# Altium schematic sheet Switch_Matrix_32_2_EEM.SchDoc: Switch Matrix 32:2
size 420 x 297 mm; EDA_Number: ARTIQ; Projet: Switch Matrix 32:2; Author: G.Kasprowicz; CompanyName: WUT ISE; DrawnBy: G.Kasprowicz; Organization: WUT ISE; Address1: PW ISE; Address2: Nowowiejska 15/19 00-665 Warsaw; Address3: gkasprow@gmail.com; DocumentNumber: 4; Revision: 2; SheetNumber: 4; SheetTotal: 6; ModifiedBy: -; CheckedDate: -; Title2: FPGA EEM connections; DivGrp: WUT ISE; Designer: G.Kasprowicz; ModifiedDate: -; ProjectName: Sensor Box
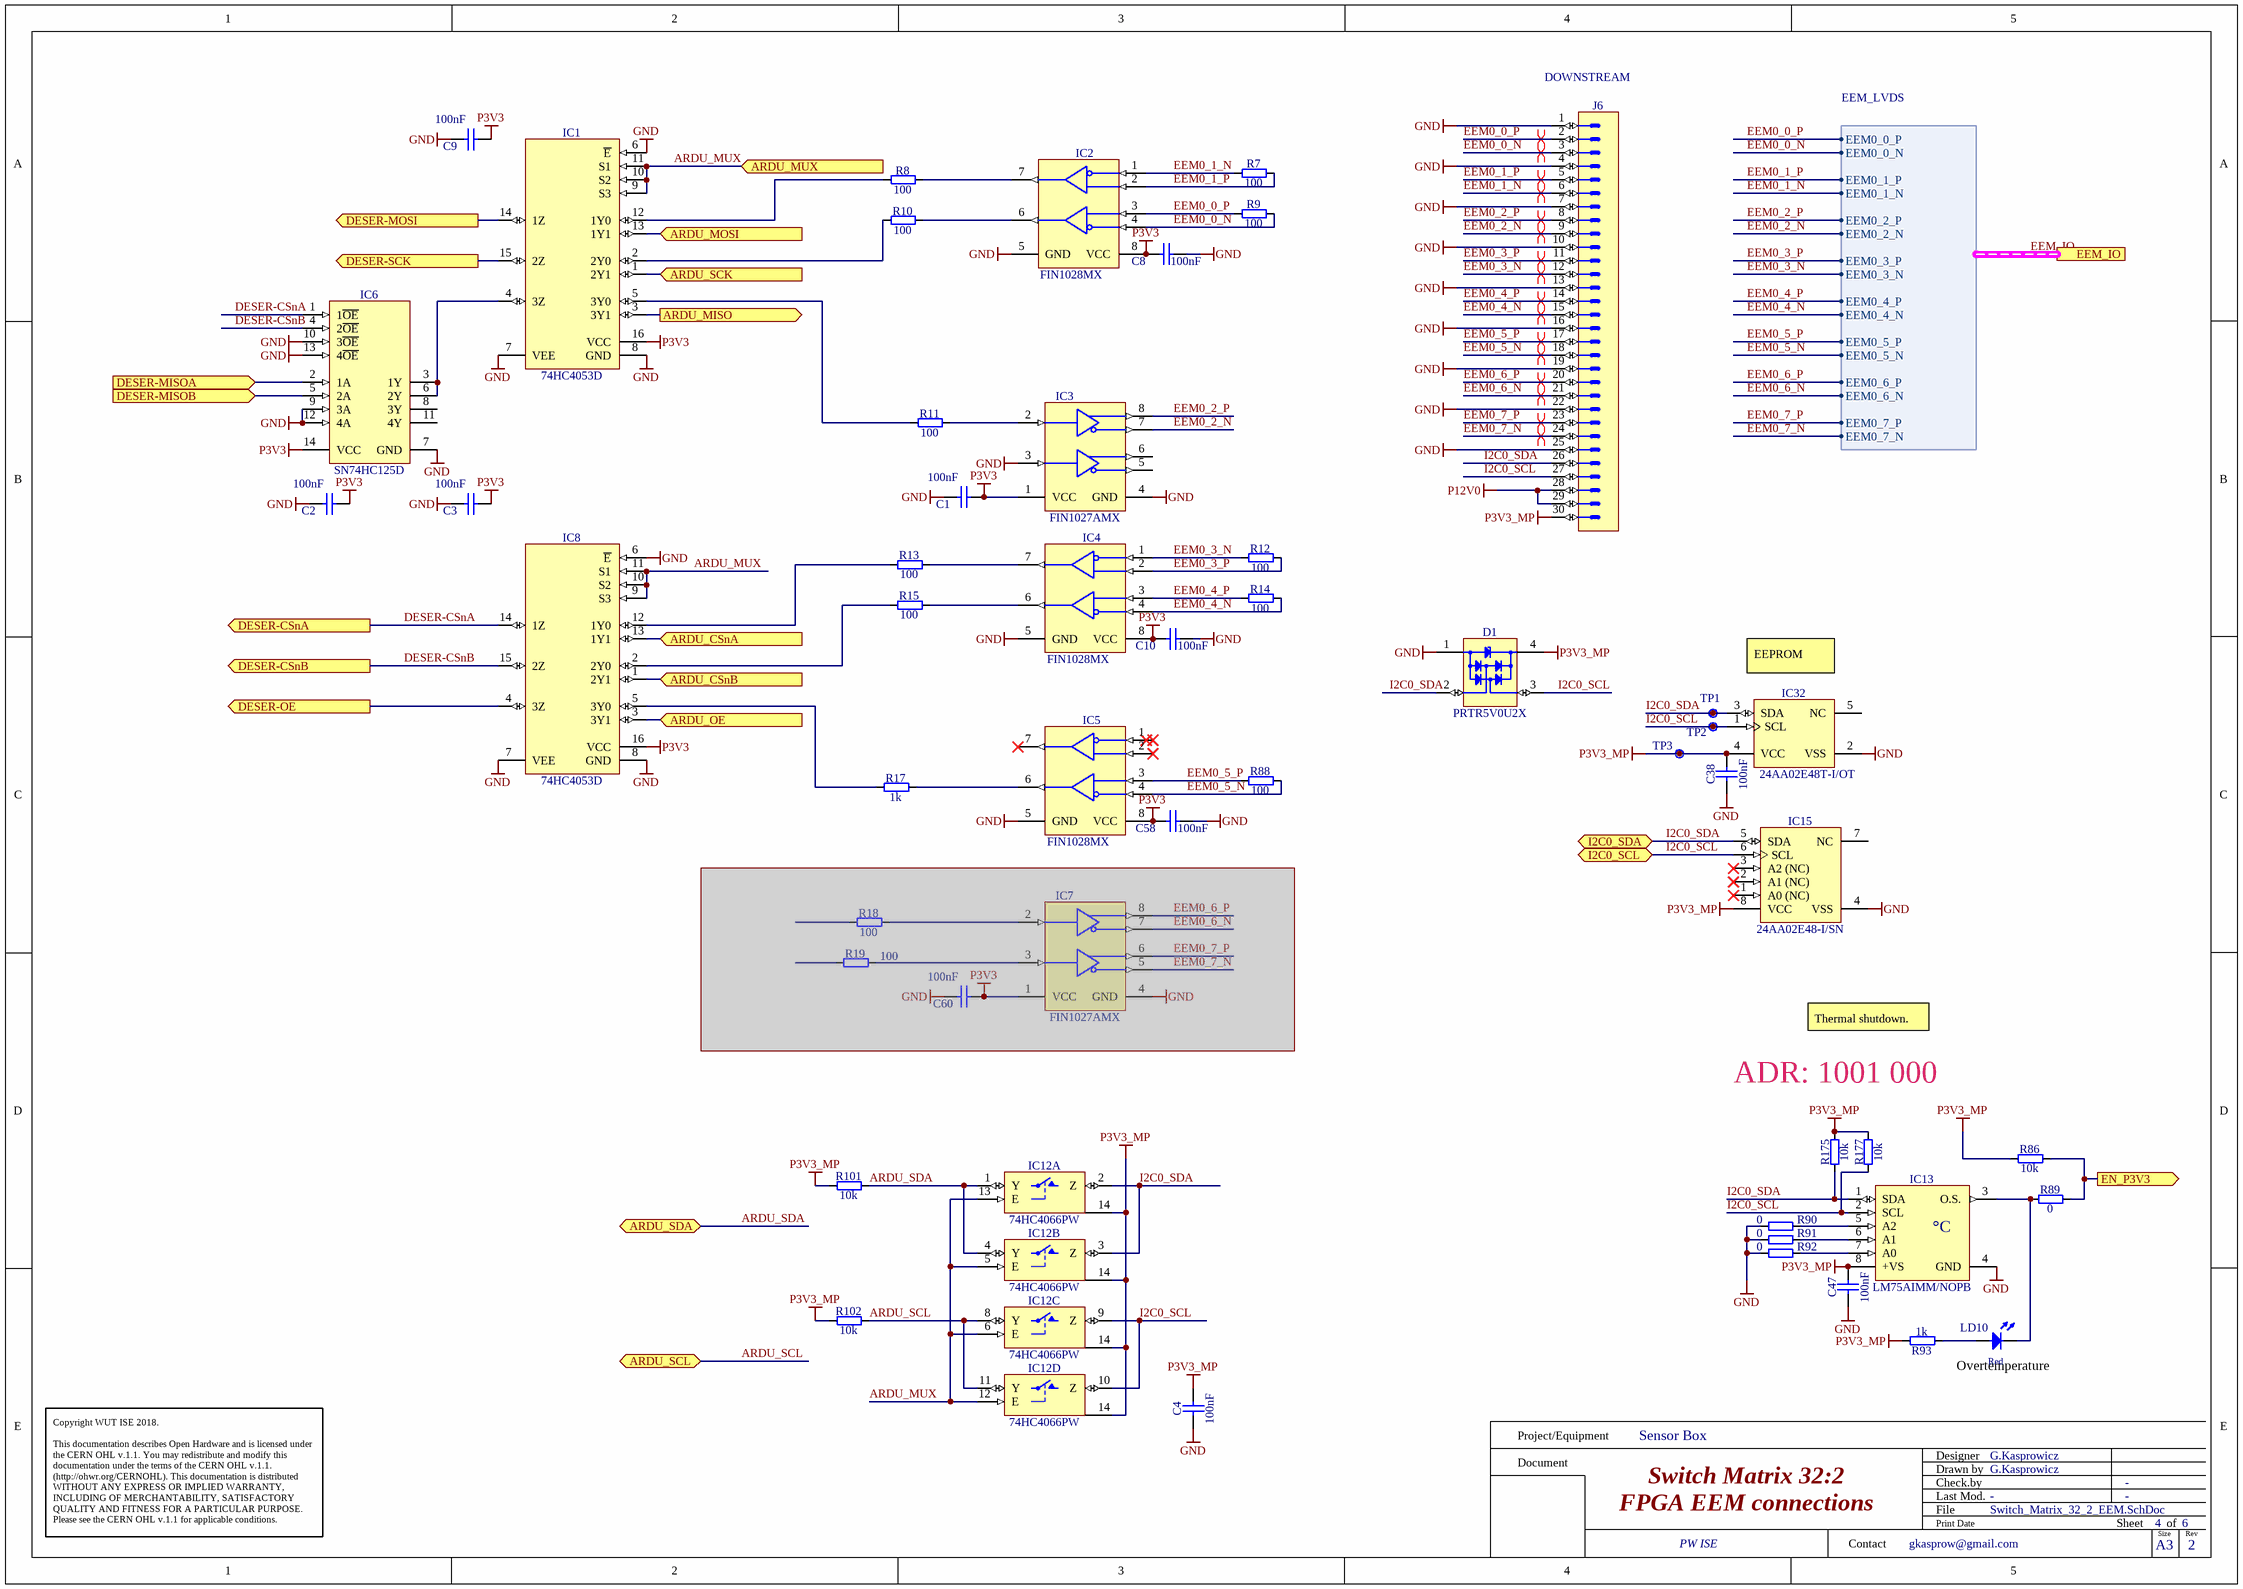
[diagram p0: Switch_Matrix_32_2_EEM.SchDoc]

## Parts
C1  100nF  [CAPC1608X87N]
C2  100nF  [CAPC1608X87N]
C3  100nF  [CAPC1608X87N]
C4  100nF  [CAPC1608X87N]
C8  100nF  [CAPC1608X87N]
C9  100nF  [CAPC1608X87N]
C10  100nF  [CAPC1608X87N]
C38  100nF  [CAPC1608X87N]
C47  100nF  [CAPC1608X87N]
C58  100nF  [CAPC1608X87N]
C60  100nF  [CAPC1608X87N]  (masked out: inside a compile mask, not in the netlist)
D1  PRTR5V0U2X  [SOT190P230X110-4N]
IC1  74HC4053D  [SOIC127P600X175-16N]
IC2  FIN1028MX  [SOIC127P600X175-8N]
IC3  FIN1027AMX  [SOIC127P600X175-8N]
IC4  FIN1028MX  [SOIC127P600X175-8N]
IC5  FIN1028MX  [SOIC127P600X175-8N]
IC6  SN74HC125D  [SOIC127P600X175-14N]
IC7  FIN1027AMX  [SOIC127P600X175-8N]  (masked out: inside a compile mask, not in the netlist)
IC8  74HC4053D  [SOIC127P600X175-16N]
IC12  74HC4066PW  [SOP65P640X110-14N]  (parts A,B,C,D of 4)
IC13  LM75AIMM/NOPB  [SOP65P490X109-8N]
IC15  24AA02E48-I/SN  [SOIC127P600X175-8N]
IC32  24AA02E48T-I/OT  [SOT95P280X145-5N]
J6  (no value)  [3M_N2530-6002RB]
LD10  Red  [LED_AVAGO_HSMC-C110]
R7  100  [RESC1608X55N]
R8  100  [RESC1608X55N]
R9  100  [RESC1608X55N]
R10  100  [RESC1608X55N]
R11  100  [RESC1608X55N]
R12  100  [RESC1608X55N]
R13  100  [RESC1608X55N]
R14  100  [RESC1608X55N]
R15  100  [RESC1608X55N]
R17  1k  [RESC1608X55N]
R18  100  [RESC1608X55N]  (masked out: inside a compile mask, not in the netlist)
R19  100  [RESC1608X55N]  (masked out: inside a compile mask, not in the netlist)
R86  10k  [RESC1608X55N]
R88  100  [RESC1608X55N]
R89  0  [RESC1608X55N]
R90  0  [RESC1608X55N]
R91  0  [RESC1608X55N]
R92  0  [RESC1608X55N]
R93  1k  [RESC1608X55N]
R101  10k  [RESC1608X55N]
R102  10k  [RESC1608X55N]
R175  10k  [RESC1608X55N]
R177  10k  [RESC1608X55N]
TP1  Test Point  [TPS127]  (value not drawn)
TP2  Test Point  [TPS127]  (value not drawn)
TP3  Test Point  [TPS127]  (value not drawn)

## Ports
ARDU_CSnA (in), ARDU_CSnB (in), ARDU_MISO (out), ARDU_MOSI (in), ARDU_MUX (in), ARDU_OE (in), ARDU_SCK (in), ARDU_SCL (bidir), ARDU_SDA (bidir), DESER-CSnA (out), DESER-CSnB (out), DESER-MISOA (in), DESER-MISOB (in), DESER-MOSI (out), DESER-OE (out), DESER-SCK (out), EEM_IO (harness EEM_LVDS), EN_P3V3 (out), I2C0_SCL (bidir), I2C0_SDA (bidir)

## Harnesses
EEM_LVDS: EEM0_0_P, EEM0_0_N, EEM0_1_P, EEM0_1_N, EEM0_2_P, EEM0_2_N, EEM0_3_P, EEM0_3_N, EEM0_4_P, EEM0_4_N, EEM0_5_P, EEM0_5_N, EEM0_6_P, EEM0_6_N, EEM0_7_P, EEM0_7_N

## Nets
GND: C1.1 C2.1 C3.1 C4.1 C8.1 C9.1 C10.1 C38.1 C47.1 C58.1 D1.1(GND) IC1.6(~{E}) IC1.7(VEE) IC1.8(GND) IC2.5(GND) IC3.3(DIN2RIN-) IC3.4(GND) IC4.5(GND) IC5.5(GND) IC6.7(GND) IC6.9(3A) IC6.10(3~{OE}) IC6.12(4A) IC6.13(4~{OE}) IC8.6(~{E}) IC8.7(VEE) IC8.8(GND) IC12.7(GND) IC13.4(GND) IC15.4(VSS) IC32.2(VSS) J6.1 J6.4 J6.7 J6.10 J6.13 J6.16 J6.19 J6.22 J6.25 R90.1 R91.1 R92.1
P3V3: C1.2 C2.2 C3.2 C8.2 C9.2 C10.2 C58.2 IC1.16(VCC) IC2.8(VCC) IC3.1(VCC) IC4.8(VCC) IC5.8(VCC) IC6.14(VCC) IC8.16(VCC)
P3V3_MP: C4.2 C38.2 C47.2 D1.4(VCC) IC12.14(VCC) IC13.8(+VS) IC15.8(VCC) IC32.4(VCC) J6.30 R86.1 R93.2 R101.1 R102.1 R175.2 R177.2 TP3.1
P12V0: J6.28 J6.29
ARDU_CSnA: IC8.13(1Y1) ; port ARDU_CSnA
ARDU_CSnB: IC8.1(2Y1) ; port ARDU_CSnB
ARDU_MISO: IC1.3(3Y1) ; port ARDU_MISO
ARDU_MOSI: IC1.13(1Y1) ; port ARDU_MOSI
ARDU_MUX: IC1.9(S3) IC1.10(S2) IC1.11(S1) IC8.9(S3) IC8.10(S2) IC8.11(S1) IC12.5(E) IC12.6(E) IC12.12(E) IC12.13(E) ; port ARDU_MUX
ARDU_OE: IC8.3(3Y1) ; port ARDU_OE
ARDU_SCK: IC1.1(2Y1) ; port ARDU_SCK
ARDU_SCL: IC12.8(Y) IC12.11(Y) R102.2 ; port ARDU_SCL
ARDU_SDA: IC12.1(Y) IC12.4(Y) R101.2 ; port ARDU_SDA
DESER-CSnA: IC6.1(1~{OE}) IC8.14(1Z) ; port DESER-CSnA
DESER-CSnB: IC6.4(2~{OE}) IC8.15(2Z) ; port DESER-CSnB
DESER-MISOA: IC6.2(1A) ; port DESER-MISOA
DESER-MISOB: IC6.5(2A) ; port DESER-MISOB
DESER-MOSI: IC1.14(1Z) ; port DESER-MOSI
DESER-OE: IC8.4(3Z) ; port DESER-OE
DESER-SCK: IC1.15(2Z) ; port DESER-SCK
EEM0_0_N: IC2.4(RIN2-) J6.3 R9.2 ; port EEM_IO.EEM0_0_N
EEM0_0_P: IC2.3(RIN2+) J6.2 R9.1 ; port EEM_IO.EEM0_0_P
EEM0_1_N: IC2.1(RIN1-) J6.6 R7.1 ; port EEM_IO.EEM0_1_N
EEM0_1_P: IC2.2(RIN1+) J6.5 R7.2 ; port EEM_IO.EEM0_1_P
EEM0_2_N: IC3.7(DOUT-) J6.9 ; port EEM_IO.EEM0_2_N
EEM0_2_P: IC3.8(DOUT+) J6.8 ; port EEM_IO.EEM0_2_P
EEM0_3_N: IC4.1(RIN1-) J6.12 R12.1 ; port EEM_IO.EEM0_3_N
EEM0_3_P: IC4.2(RIN1+) J6.11 R12.2 ; port EEM_IO.EEM0_3_P
EEM0_4_N: IC4.4(RIN2-) J6.15 R14.2 ; port EEM_IO.EEM0_4_N
EEM0_4_P: IC4.3(RIN2+) J6.14 R14.1 ; port EEM_IO.EEM0_4_P
EEM0_5_N: IC5.4(RIN2-) J6.18 R88.2 ; port EEM_IO.EEM0_5_N
EEM0_5_P: IC5.3(RIN2+) J6.17 R88.1 ; port EEM_IO.EEM0_5_P
EEM0_6_N: J6.21 ; port EEM_IO.EEM0_6_N
EEM0_6_P: J6.20 ; port EEM_IO.EEM0_6_P
EEM0_7_N: J6.24 ; port EEM_IO.EEM0_7_N
EEM0_7_P: J6.23 ; port EEM_IO.EEM0_7_P
EN_P3V3: R86.2 R89.2 ; port EN_P3V3
I2C0_SCL: D1.3(I/O2) IC12.9(Z) IC12.10(Z) IC13.2(SCL) IC15.6(SCL) IC32.1(SCL) J6.27 R177.1 TP2.1 ; port I2C0_SCL
I2C0_SDA: D1.2(I/O1) IC12.2(Z) IC12.3(Z) IC13.1(SDA) IC15.5(SDA) IC32.3(SDA) J6.26 R175.1 TP1.1 ; port I2C0_SDA
NetIC1_2: IC1.2(2Y0) R10.1
NetIC1_4: IC1.4(3Z) IC6.3(1Y) IC6.6(2Y)
NetIC1_5: IC1.5(3Y0) R11.1
NetIC1_12: IC1.12(1Y0) R8.1
NetIC2_6: IC2.6(ROUT2) R10.2
NetIC2_7: IC2.7(ROUT1) R8.2
NetIC3_2: IC3.2(DIN1) R11.2
NetIC4_6: IC4.6(ROUT2) R15.2
NetIC4_7: IC4.7(ROUT1) R13.2
NetIC5_6: IC5.6(ROUT2) R17.2
NetIC8_2: IC8.2(2Y0) R15.1
NetIC8_5: IC8.5(3Y0) R17.1
NetIC8_12: IC8.12(1Y0) R13.1
NetIC13_3: IC13.3(O.S.) LD10.1(C) R89.1
NetIC13_5: IC13.5(A2) R90.2
NetIC13_6: IC13.6(A1) R91.2
NetIC13_7: IC13.7(A0) R92.2
NetLD10_2: LD10.2(A) R93.1

Not connected (* = marked no-connect by the designer): IC3 5(DOUT-) 6(DOUT+); IC5 1(RIN1-)* 2(RIN1+)* 7(ROUT1)*; IC6 8(3Y) 11(4Y); IC15 1(A0_(NC))* 2(A1_(NC))* 3(A2_(NC))* 7(NC); IC32 5(NC)

## Buses and harness runs
harness EEM_IO = port EEM_IO

## Layout directives
differential pair: EEM0_0_N, EEM0_0_P, EEM0_1_N, EEM0_1_P, EEM0_2_N, EEM0_2_P, EEM0_3_N, EEM0_3_P, EEM0_4_N, EEM0_4_P, EEM0_5_N, EEM0_5_P, EEM0_6_N, EEM0_6_P, EEM0_7_N, EEM0_7_P

## Notes on the sheet
- (near J6) DOWNSTREAM
- EEPROM
- Thermal shutdown.
- ADR: 1001 000
- Overtemperature
- Project/Equipment
- Document
- Designer
- Drawn by
- Check.by
- Copyright WUT ISE 2018.
  This documentation describes Open Hardware and is licensed under the CERN OHL v.1.1. You may redistribute and modify this documentation under the terms of the CERN OHL v.1.1. (http://ohwr.org/CERNOHL). This documentation is distributed WITHOUT ANY EXPRESS OR IMPLIED WARRANTY, INCLUDING OF MERCHANTABILITY, SATISFACTORY QUALITY AND FITNESS FOR A PARTICULAR PURPOSE. Please see the CERN OHL v.1.1 for applicable conditions.
- Contact
- File
- Last Mod.
- Print Date
- Sheet
- Size
- A3
- of
- Rev
- (in symbol LM75AIMM/NOPB) °C

## Library data of the parts
C1-C4 C8-C10 C38 C47 C58 C60 = CC0603_100NF_50V_10%_X7R: Non-polarised capacitor; Part Description: SMD Multilayer Chip Ceramic Capacitor; Manufacturer: GENERIC; Manufacturer1 Part Number: 223858615649; Voltage: 50V; TC: X7R; Tolerance: ±10%; Part Number: CC0603_100NF_50V_10%_X7R; Component Kind: Standard; Component Type: Standard; Pin Count: 2; Value: 100nF; Status: Preferred; Manufacturer Part Number: CC0603_100NF_50V_10%_X7R; Case: 0603; Mounted: Yes; Socket: No; SMD: Yes; Sense: No; Manufacturer1 Example: PHYCOMP; Manufacturer1 ComponentHeight: 0.87mm; HelpURL: \\cern.ch\dfs\Applications\Altium\Datasheets\CC0603_X7R_PHYCOMP.pdf; Author: CERN DEM JLC; CreateDate: 03.12.2007; LatestRevisionDate: 03.12.2007
D1 = PRTR5V0U2X: Ultra Low Capacitance Double Rail-to-Rail ESD Protection Diode; Part Description: Ultra Low Capacitance (1pF) Double Rail-to-Rail ESD Protection Diode (8kV); Manufacturer: NXP SEMICONDUCTORS; Voltage: 5.5V; PressFit: No; Bonding: No; Part Number: PRTR5V0U2X; Component Kind: Standard; Component Type: Standard; Device: PRTR5V0U2X; PackageDescription: SOT143B, SOT, 1.90mm Pitch; 4 Pin, 1.30mm W X 2.90mm L X 1.10mm H body, IPC Medium Density; Manufacturer Part Number: PRTR5V0U2X; Pin Count: 4; Case: SOT143B; Mounted: Yes; Socket: No; SMD: Yes; Sense: No; ComponentHeight: 1.1mm; HelpURL: \\cern.ch\dfs\Applications\Altium\Datasheets\PRTR5V0U2X.pdf; Author: CERN DEM JLC; CreateDate: 22.03.2011; LatestRevisionDate: 22.03.2011
IC1 IC8 = 74HC4053D: Triple 2-Channel Analog Multiplexer/Demultiplexer; Manufacturer: NXP SEMICONDUCTORS; PressFit: No; Bonding: No; Part Number: 74HC4053D; Component Kind: Standard; Component Type: Standard; Device: 74HC4053D; PackageDescription: SOIC 16, Pitch 1.27mm - Body 4x10mm, IPC Medium Density; Part Description: Triple 2-channel analog multiplexer/demultiplexer; Manufacturer Part Number: 74HC4053D; Pin Count: 16; Case: SOIC16; Mounted: Yes; Socket: No; SMD: Yes; Sense: No; ComponentHeight: 1.75mm; Author: CERN DEM JLC; HelpURL: \\cern.ch\dfs\Applications\Altium\Datasheets\74HC4053D.pdf; CreateDate: 09.11.2016; LatestRevisionDate: 09.11.2016
IC2 IC4 IC5 = IFC_FIN1028: 3.3V LVDS 2-Bit High-Speed Differential Reciever; Manufacturer: ON Semiconductor; PressFit: No; Bonding: No; Part Number: FIN1028MX; Component Kind: Standard; Component Type: Standard; Device: FIN1028MX; PackageDescription: SOIC 8, Pitch 1.27mm - Body 4x5mm, IPC Medium Density; Part Description: 3.3V LVDS 2-Bit High-Speed Differential Reciever; Manufacturer Part Number: FIN1028MX; Pin Count: 8; Case: SOIC8; Mounted: Yes; Socket: No; SMD: Yes; Sense: No; ComponentHeight: 0.8mm; Author: GK; HelpURL: \\cern.ch\dfs\Applications\Altium\Datasheets\FIN1101K8X.pdf; CreateDate: 08/11/2016; LatestRevisionDate: 08/11/2016
IC3 IC7 = IFC_FIN1027A: 3.3V LVDS, 2-Bit, High-Speed, Differential Driver; Manufacturer: ON Semiconductor; PressFit: No; Bonding: No; Part Number: FIN1027AMX; Component Kind: Standard; Component Type: Standard; Device: FIN1027AMX; PackageDescription: SOIC 8, Pitch 1.27mm - Body 4x5mm, IPC Medium Density; Part Description: 3.3V LVDS, 2-Bit, High-Speed, Differential Driver; Manufacturer Part Number: FIN1027AMX; Pin Count: 8; Case: SOIC8; Mounted: Yes; Socket: No; SMD: Yes; Sense: No; ComponentHeight: 0.8mm; Author: GK; HelpURL: \\cern.ch\dfs\Applications\Altium\Datasheets\FIN1101K8X.pdf; CreateDate: 08/11/2016; LatestRevisionDate: 08/11/2016
IC6 = SN74HC125D: Quadruple Bus Buffer with 3-State Outputs; Manufacturer: TEXAS INSTRUMENTS; PressFit: No; Bonding: No; Part Number: SN74HC125D; Component Kind: Standard; Component Type: Standard; Device: SN74HC125D; PackageDescription: SOIC 14, Pitch 1.27mm - Body 4x8.75mm, IPC Medium Density; Part Description: Quadruple Bus Buffer with 3-State Outputs; Manufacturer Part Number: SN74HC125D; Pin Count: 14; Case: SOIC14; Mounted: Yes; Socket: No; SMD: Yes; Sense: No; ComponentHeight: 1.75mm; Author: CERN DEM JLC; HelpURL: \\cern.ch\dfs\Applications\Altium\Datasheets\SN74HC125D.pdf; CreateDate: 30.06.2011; LatestRevisionDate: 30.06.2011
IC12 = 74HC4066PW: Part Description: Quad Single-Pole Single-Throw Analog Switch; Manufacturer: NXP SEMICONDUCTORS; PressFit: No; Bonding: No; Part Number: 74HC4066PW; Component Kind: Standard; Component Type: Standard; Device: 74HC4066PW; PackageDescription: SOP, 14-Leads, Body 4.4x5mm (max), Pitch 0.65mm, IPC Medium Density; Manufacturer Part Number: 74HC4066PW; Pin Count: 14; Case: TSSOP14; Mounted: Yes; Socket: No; SMD: Yes; Sense: No; ComponentHeight: 1.1mm; Author: CERN DEM JLC; HelpURL: \\cern.ch\dfs\Applications\Altium\Datasheets\74HC4066PW.pdf; CreateDate: 19.11.2014; LatestRevisionDate: 19.11.2014
IC13 = LM75AIMM/NOPB: Digital Temperature Sensor and Thermal Watchdog with Two-Wire Interface; Part Description: -25° to +100°C ±2°C Digital Temperature Sensor and Thermal Watchdog with Two-Wire Interface; Manufacturer: TEXAS INSTRUMENTS; PressFit: No; Bonding: No; Part Number: LM75AIMM/NOPB; Component Kind: Standard; Component Type: Standard; Device: LM75AIMM/NOPB; PackageDescription: SOP, 0.65mm pitch; 8 pin,3.00mm W X 3.00mm L X 1.09mm H bodyI, PC Medium Density; Manufacturer Part Number: LM75AIMM/NOPB; Pin Count: 8; Case: SSOP8; Mounted: Yes; Socket: No; SMD: Yes; Sense: No; ComponentHeight: 1.09mm; HelpURL: \\cern.ch\dfs\Applications\Altium\Datasheets\LM75AIMM-NOPB.pdf; Author: CERN DEM JLC; CreateDate: 15.10.2012; LatestRevisionDate: 15.10.2012
IC15 = MEM_24AA02E48-I/SN: 1.7V-5.5V, 2K I2C™ Serial EEPROMs with EUI-48™ Node Identity; Manufacturer: MICROCHIP TECHNOLOGY; PressFit: No; Bonding: No; Part Number: 24AA02E48-I/SN; Component Kind: Standard; Component Type: Standard; Device: 24AA02E48-I/SN; PackageDescription: SOIC, 1.27mm Pitch; 8 Pin - Body 4x5mm, IPC Medium Density; Part Description: 1.7V-5.5V, 2K I2C™ Serial EEPROMs with EUI-48™ Node Identity; Manufacturer Part Number: 24AA02E48-I/SN; Pin Count: 8; Case: SOIC8; Mounted: Yes; Socket: No; SMD: Yes; Sense: No; ComponentHeight: 1.75mm; HelpURL: \\cern.ch\dfs\Applications\Altium\Datasheets\24AA025E48-I-SN.pdf; Author: CERN DEM MR; CreateDate: 19.07.2016; LatestRevisionDate: 19.07.2016
IC32 = 24AA02E48T-I/OT: 1.7V-5.5V, 2K I2C Serial EEPROM With EUI-48 Node Identity; Manufacturer: MICROCHIP TECHNOLOGY; PressFit: No; Bonding: No; Part Number: 24AA02E48T-I/OT; Component Kind: Standard; Component Type: Standard; Device: 24AA02E48T-I/OT; PackageDescription: SOT, 0.95mm pitch; 5 pin, 1.60mm W X 2.90mm L X 1.45mm H body, IPC Medium Density; Part Description: 1.7V-5.5V, 2K I2C Serial EEPROM With EUI-48 Node Identity; Manufacturer Part Number: 24AA02E48T-I/OT; Pin Count: 5; Case: SOT23-5; Mounted: Yes; Socket: No; SMD: Yes; Sense: No; ComponentHeight: 1.45mm; HelpURL: \\cern.ch\dfs\Applications\Altium\Datasheets\24AA02E48T-I-OT.pdf; Author: CERN DEM MR; CreateDate: 31.03.2016; LatestRevisionDate: 31.03.2016
J6 = 3M_N2530-6002RB: Connector 30 Male; Part Description: 30 Contacts - Straight .100'' x .100'' Low Profile Four-Wall Header, 2500 Series; Manufacturer: 3M; PressFit: No; Part Number: 3M_N2530-6002RB; Component Kind: Standard; Component Type: Standard; Pin Count: 30; Family: Header 30; Mounted: Yes; Socket: No; SMD: No; Sense: No; Status: None; Manufacturer Part Number: N2530-6002RB; ComponentHeight: 10.03mm; HelpURL: \\cern.ch\dfs\Applications\Altium\Datasheets\3M_N2530-6002RB.pdf; Author: CERN DEM JLC; CreateDate: 11.02.2009; LatestRevisionDate: 11.08.2009
LD10 = LED_AVAGO_HSMC-C110: LED Red 1C 2A; Part Description: High Performance Right Angle Chip Red LED; Manufacturer: AVAGO TECHNOLOGIES; PressFit: No; Bonding: No; Part Number: LED_AVAGO_HSMC-C110; Component Kind: Standard; Component Type: Standard; Color: Red; PackageDescription: Red Chip LED, 2-Leads, Body 3.3x1.6mm, Side Emitting Package; Manufacturer Part Number: HSMC-C110; Pin Count: 2; Case: 1206; Mounted: Yes; Socket: No; SMD: Yes; Sense: No; ComponentHeight: 1.1mm; HelpURL: \\cern.ch\dfs\Applications\Altium\Datasheets\LED_AVAGO_HSMC-C110.pdf; ComponentLink1URL: \\cern.ch\dfs\Applications\Altium\Datasheets\LED_AVAGO_HSMC-C110_DESIGN-GUIDE.pdf; ComponentLink1Description: Design Guide; Author: CERN DEM JMW; CreateDate: 30.07.2009; LatestRevisionDate: 20.06.2012
R7-R15 R18 R19 R88 = R0603_100R_1%_0.1W_100PPM: Resistor - 1%; Part Description: General Purpose Thick Film Chip Resistor; Manufacturer: GENERIC; Manufacturer1 Part Number: NRC06F4700TRF; Power: 0.1W; TC: ±100ppm/°C; PressFit: No; Part Number: R0603_100R_1%_0.1W_100PPM; Component Kind: Standard; Component Type: Standard; Pin Count: 2; Value: 100; Status: Preferred; Tolerance: ±1%; Manufacturer Part Number: R0603_100R_1%_0.1W_100PPM; Case: 0603; Mounted: Yes; Sense: No; Socket: No; SMD: Yes; Manufacturer1 Example: NIC COMPONENT; Manufacturer1 ComponentHeight: 0.55mm; HelpURL: \\cern.ch\dfs\Applications\Altium\Datasheets\R0603_NIC_NRC.pdf; Author: CERN DEM JLC; CreateDate: 03.12.2007; LatestRevisionDate: 13.03.2008
R17 R93 = R0603_1K_1%_0.1W_100PPM: Resistor - 1%; Part Description: General Purpose Thick Film Chip Resistor; Manufacturer: GENERIC; Manufacturer1 Part Number: NRC06F1001TRF; Power: 0.1W; TC: ±100ppm/°C; PressFit: No; Part Number: R0603_1K_1%_0.1W_100PPM; Component Kind: Standard; Component Type: Standard; Pin Count: 2; Value: 1k; Status: Preferred; Tolerance: ±1%; Manufacturer Part Number: R0603_1K_1%_0.1W_100PPM; Case: 0603; Mounted: Yes; Sense: No; Socket: No; SMD: Yes; Manufacturer1 Example: NIC COMPONENT; Manufacturer1 ComponentHeight: 0.55mm; HelpURL: \\cern.ch\dfs\Applications\Altium\Datasheets\R0603_NIC_NRC.pdf; Author: CERN DEM JLC; CreateDate: 03.12.2007; LatestRevisionDate: 13.03.2008
R86 R101 R102 R175 R177 = R0603_10K_1%_0.1W_100PPM: Resistor - 1%; Part Description: General Purpose Thick Film Chip Resistor; Manufacturer: GENERIC; Manufacturer1 Part Number: NRC06F1002TRF; Power: 0.1W; TC: ±100ppm/°C; PressFit: No; Part Number: R0603_10K_1%_0.1W_100PPM; Component Kind: Standard; Component Type: Standard; Pin Count: 2; Value: 10k; Status: Preferred; Tolerance: ±1%; Manufacturer Part Number: R0603_10K_1%_0.1W_100PPM; Case: 0603; Mounted: Yes; Sense: No; Socket: No; SMD: Yes; Manufacturer1 Example: NIC COMPONENT; Manufacturer1 ComponentHeight: 0.55mm; HelpURL: \\cern.ch\dfs\Applications\Altium\Datasheets\R0603_NIC_NRC.pdf; Author: CERN DEM JLC; CreateDate: 03.12.2007; LatestRevisionDate: 13.03.2008
R89-R92 = R0603_0R_JUMPER: Resistor; Part Description: 1A (0.05R Max DC Resistance) Zero Ohm Jumper; Manufacturer: GENERIC; Manufacturer1 Part Number: NRC06Z0; PressFit: No; Part Number: R0603_0R_JUMPER; Component Kind: Standard; Component Type: Standard; Pin Count: 2; Value: 0; Status: Preferred; Manufacturer Part Number: R0603_0R_JUMPER; Case: 0603; Mounted: Yes; Sense: No; Socket: No; SMD: Yes; Manufacturer1 Example: NIC COMPONENT; Manufacturer1 ComponentHeight: 0.55mm; HelpURL: \\cern.ch\dfs\Applications\Altium\Datasheets\R0603_NIC_NRC.pdf; Author: CERN DEM JLC; CreateDate: 03.12.2007; LatestRevisionDate: 13.03.2008
TP1-TP3 = SMD_PAD_1.27X1.27MM: Part Description: 1.27mm x 1.27mm PCB Copper Area (SMD Test Point); Mounted: No; Part Number: SMD_PAD_1.27X1.27MM; Component Kind: Standard (No BOM); Component Type: Standard (No BOM); Pin Count: 1; Family: Test Point; Socket: No; SMD: Yes; Sense: No; Status: None; ComponentHeight: 0mm; HelpURL: Undefined; Author: CERN DEM JLC; CreateDate: 12.01.2008; LatestRevisionDate: 12.01.2008; PackageDescription: 1.27mm x 1.27mm PCB Copper Area (SMD Test Point)